# Altium schematic sheet ImprovedBlackPill.SchDoc
size A4; SheetNumber: 2; SheetTotal: 2
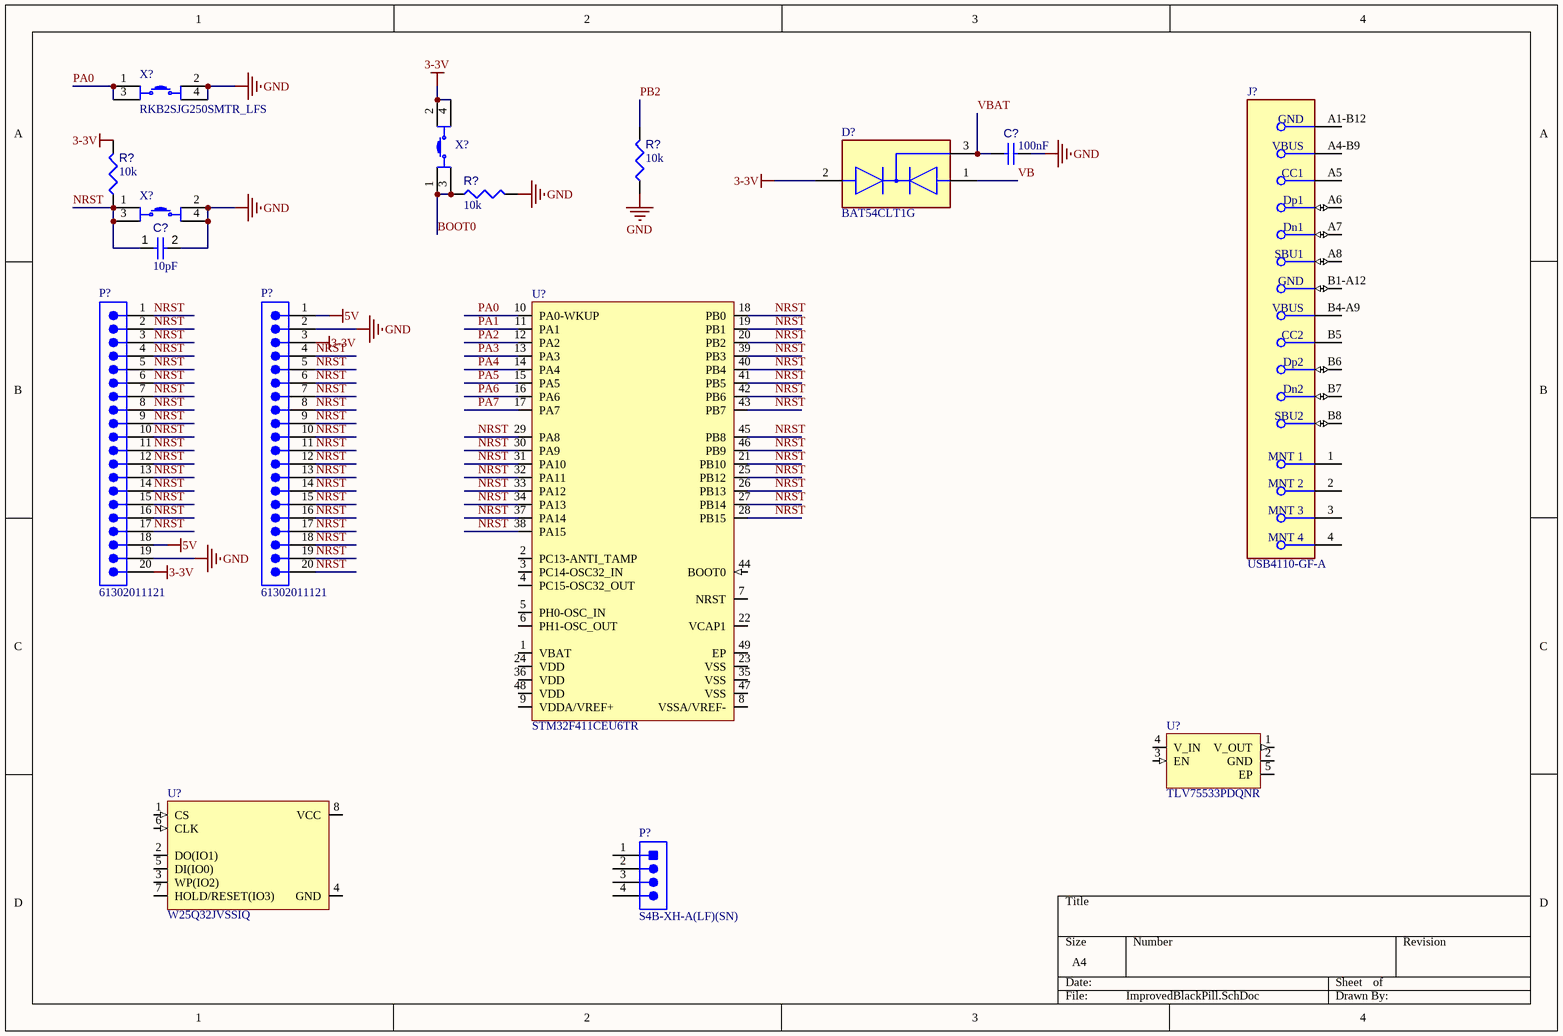
[diagram p0: ImprovedBlackPill.SchDoc]

## Parts
(Parts that share a designator on the sheet are numbered #1, #2 ... from top to bottom, then left to right.)
C?#1  value 100nF  [CAPC1005X55X25ML05T10]  (hidden comment: Capacitor 1 uF +/- 10% 6.3 V 0402)
C?#2  value 10pF  [CAPC1005X55X25ML05T05]  (hidden comment: Capacitor 10 pF +/- 5% 50 V 0402)
D?  BAT54CLT1G  [FP-318-08-IPC_C]
J?  USB4110-GF-A  [FP-USB4110-GF-A-MFG]
P?#1  61302011121  [61302011121]
P?#2  61302011121  [61302011121]
P?#3  S4B-XH-A(LF)(SN)  [JST-S4B-XH-A(LF)(SN)_V]
R?#1  value 10k  [RESC1005X40X25ML10T10]  (hidden comment: Resistor 15k +/-1% 0402 63 mW)
R?#2  value 10k  [RESC1005X40X25ML10T10]  (hidden comment: Resistor 15k +/-1% 0402 63 mW)
R?#3  value 10k  [RESC1005X40X25ML10T10]  (hidden comment: Resistor 15k +/-1% 0402 63 mW)
U?#1  STM32F411CEU6TR  [STM-UFQFPN48_N]
U?#2  TLV75533PDQNR  [AP7343D-18FS4-7B-Footprint-1]
U?#3  W25Q32JVSSIQ  [SOIC127P790X216-8N]
X?#1  RKB2SJG250SMTR_LFS  [RKB2SJG250SMTRLFS]
X?#2  RKB2SJG250SMTR_LFS  [RKB2SJG250SMTRLFS]  (value not drawn)
X?#3  RKB2SJG250SMTR_LFS  [RKB2SJG250SMTRLFS]  (value not drawn)

## Nets
3-3V: D?.2(2_ANODE) P?#1.20 P?#2.3 R?#3.2 X?#2.2(COM_2) X?#2.4(NO_2)
5V: P?#1.18 P?#2.1
GND: C?#1.2 C?#2.2 P?#1.19 P?#2.2 R?#1.2 R?#2.1 X?#1.2(COM_2) X?#1.4(NO_2) X?#3.2(COM_2) X?#3.4(NO_2)
BOOT0: R?#1.1 X?#2.1(COM_1) X?#2.3(NO_1)
NRST: C?#2.1 P?#1.1 P?#1.2 P?#1.3 P?#1.4 P?#1.5 P?#1.6 P?#1.7 P?#1.8 P?#1.9 P?#1.10 P?#1.11 P?#1.12 P?#1.13 P?#1.14 P?#1.15 P?#1.16 P?#1.17 P?#2.4 P?#2.5 P?#2.6 P?#2.7 P?#2.8 P?#2.9 P?#2.10 P?#2.11 P?#2.12 P?#2.13 P?#2.14 P?#2.15 P?#2.16 P?#2.17 P?#2.18 P?#2.19 P?#2.20 R?#3.1 U?#1.18(PB0) U?#1.19(PB1) U?#1.20(PB2) U?#1.21(PB10) U?#1.25(PB12) U?#1.26(PB13) U?#1.27(PB14) U?#1.28(PB15) U?#1.29(PA8) U?#1.30(PA9) U?#1.31(PA10) U?#1.32(PA11) U?#1.33(PA12) U?#1.34(PA13) U?#1.37(PA14) U?#1.38(PA15) U?#1.39(PB3) U?#1.40(PB4) U?#1.41(PB5) U?#1.42(PB6) U?#1.43(PB7) U?#1.45(PB8) U?#1.46(PB9) X?#3.1(COM_1) X?#3.3(NO_1)
PA0: U?#1.10(PA0-WKUP) X?#1.1(COM_1) X?#1.3(NO_1)
PA1: U?#1.11(PA1)
PA2: U?#1.12(PA2)
PA3: U?#1.13(PA3)
PA4: U?#1.14(PA4)
PA5: U?#1.15(PA5)
PA6: U?#1.16(PA6)
PA7: U?#1.17(PA7)
PB2: R?#2.2
VB: D?.1(1_ANODE)
VBAT: C?#1.1 D?.3(C)

Not connected (* = marked no-connect by the designer): J? 1(MNT_1) 2(MNT_2) 3(MNT_3) 4(MNT_4) A1-B12(GND) A4-B9(VBUS) A5(CC1) A6(Dp1) A7(Dn1) A8(SBU1) B1-A12(GND) B4-A9(VBUS) B5(CC2) B6(Dp2) B7(Dn2) B8(SBU2); P?#3 1 2 3 4; U?#1 1(VBAT) 2(PC13-ANTI_TAMP) 3(PC14-OSC32_IN) 4(PC15-OSC32_OUT) 5(PH0-OSC_IN) 6(PH1-OSC_OUT) 7(NRST) 8(VSSA/VREF-) 9(VDDA/VREF+) 22(VCAP1) 23(VSS) 24(VDD) 35(VSS) 36(VDD) 44(BOOT0) 47(VSS) 48(VDD) 49(EP); U?#2 1(V_OUT) 2(GND) 3(EN) 4(V_IN) 5(EP); U?#3 1(CS) 2(DO(IO1)) 3(WP(IO2)) 4(GND) 5(DI(IO0)) 6(CLK) 7(HOLD/RESET(IO3)) 8(VCC)

## Library data of the parts
C?#1 = CMP-001-00008-6: Chip Capacitor, 1 uF, +/- 10%, 6.3 V, 0402 (1005 Metric); Capacitor Type: Ceramic; Voltage Rating: 6.3V; Max Operating Temperature: 85°C; Mounting Technology: SM; Tolerance: 10%; Case/Package: 0402; RoHS Compliant: True; Min Operating Temperature: -55°C; Pins: 2
C?#2 = CMP-001-00013-6: Chip Capacitor, 10 pF, +/- 5%, 50 V, 0402 (1005 Metric); Capacitor Type: Ceramic; Voltage Rating: 50V; Max Operating Temperature: 125°C; Pins: 2; Mounting Technology: SM; Tolerance: 5%; RoHS Compliant: True; Case/Package: 0402; Min Operating Temperature: -55°C
D? = CMP-00000-1: Rectifier Diode, Schottky, 2 Element, 0.1A, 30V V(RRM), Silicon, TO-236; Reverse Recovery Time-Max: 0.005us; Max Power Dissipation: 225mW; Max Output current: 100mA; Non-rep Pk Forward Current-Max: 600mA; Qualification Status: Not Qualified; Package Body Material: Plastic; Forward Voltage: 240mV; Time @ Peak Reflow Temperature-Max (s): 40s; Number of Elements: 2; Terminal Finish: Tin; Diode Element Material: SILICON; JESD-609 Code: e3; Peak Reflow Temperature (Cel): 260°C; JEDEC-95 Code: TO-236; Technology: SCHOTTKY; Surface Mount: Yes; Package Shape: Rectangular; RoHS Compliant: Yes; Pins: 3; Moisture Sensitivity Level: 1; Max Operating Temperature: 125°C; Diode Type: RECTIFIER; Terminal Position: DUAL; Terminal Form: Gull Wing; Reach SVHC Compliant: Yes; Package Style: SMALL OUTLINEMeter; JESD-30 Code: R-PDSO-G3; Rep Pk Reverse Voltage-Max: 30V; Min Operating Temperature: -55°C
J? = CMP-002-00072-1: USB Connector, 16 Contact(s), Male, Right Angle, Surface Mount Terminal, Locking, Receptacle
P?#1 P?#2 = CMP-002-00071-1: Board Connector, 20 Contact(s), 1 Row(s), Male, Straight, 0.1 inch Pitch, Solder Terminal, Locking, Black Insulator, Plug; RoHS Compliant: Yes; Min Operating Temperature: -40°C; Mounting Technology: Board; Connector Type: BOARD CONNECTOR; Max Operating Temperature: 125°C
P?#3 = CMP-002-00034-2: Male Header, Pitch 2.5 mm, 1 x 4 Position, Height 6.1 mm, Tail Length 3.4 mm, -25 to 85 degC, RoHS, Bulk; Manufacturer: JST; Manufacturer URL: http://www.jst.com/home2.html; RoHS Compliant: Unknown; Gender: Male; Min Operating Temperature: -25°C; Datasheet URL: http://www.jst-mfg.com/product/pdf/eng/eXH.pdf; Case/Package: S4B-XH-A(LF)(SN); Datasheet Version: May-16; Mounting Technology: TH; Package Reference: S4B-XH-A(LF)(SN); Max Operating Temperature: 85°C; Package Description: XH Series Disconnectable Crimp Style Connector, Pitch 2.5 mm, 1 x 4 Position, Height 6.1 mm, Tail Length 3.4 mm; Connector Type: Header
R?#1-R?#3 = CMP-009-00026-5: Chip Resistor, 15 KOhm, +/- 1%, 0.063 W, -55 to 155 degC, 0402 (1005 Metric); Power: 63mW; Min Operating Temperature: -55°C; Tolerance: 1%; Max Operating Temperature: 155°C; Mounting Technology: SM; Case/Package: 0402; RoHS Compliant: True; Pins: 2
U?#1 = CMP-020-00023-2: RISC Microcontroller, 32-Bit, FLASH, CORTEX-M4 CPU, 100MHz, CMOS; Nominal Supply Voltage: 3.3V; Max Supply Voltage: 3.6V; Min Supply Voltage: 1.7V; RoHS Compliant: Yes; Max Operating Temperature: 85°C; Case/Package: HVQCCN; Min Operating Temperature: -40°C; Pins: 48
U?#2 = CMP-019-00051-1: Fixed Positive LDO Regulator, 3.3V, 0.238V Dropout, PBCC4; RoHS Compliant: Yes
U?#3 = CMP-019-00049-2: Flash, 4MX8, PDSO8; Min Supply Voltage: 2.7V; Memory Size: 4194304; Max Supply Voltage: 3.6V; Clock Frequency: 133MHz; Min Operating Temperature: -40°C; Case/Package: SOP; RoHS Compliant: Yes; Memory Format: FLASH; Pins: 8; Max Operating Temperature: 85°C
X?#1-X?#3 = CMP-008-000000-3: Tactile Switches J Bend SMT Term 400gf Force; Manufacturer_Part_Number: RKB2SJG250SMTR LFS; Manufacturer_Name: C & K COMPONENTS; Geometry.Height: 2.7mm; Mouser Part Number: 611-RKB2SJG250SMTRLF; Datasheet Link: https://www.ckswitches.com/media/3130/ck_rk_datasheet.pdf; Mouser Price/Stock: https://www.mouser.co.uk/ProductDetail/CK/RKB2SJG250SMTR-LFS?qs=iLbezkQI%252Bsgsc0TY%2FPaT8A%3D%3D; Source: RKB2SJG250SMTR_LFS.SchLib; Design Item ID: RKB2SJG250SMTR_LFS